# Altium schematic sheet CurrentSensing.SchDoc
size A
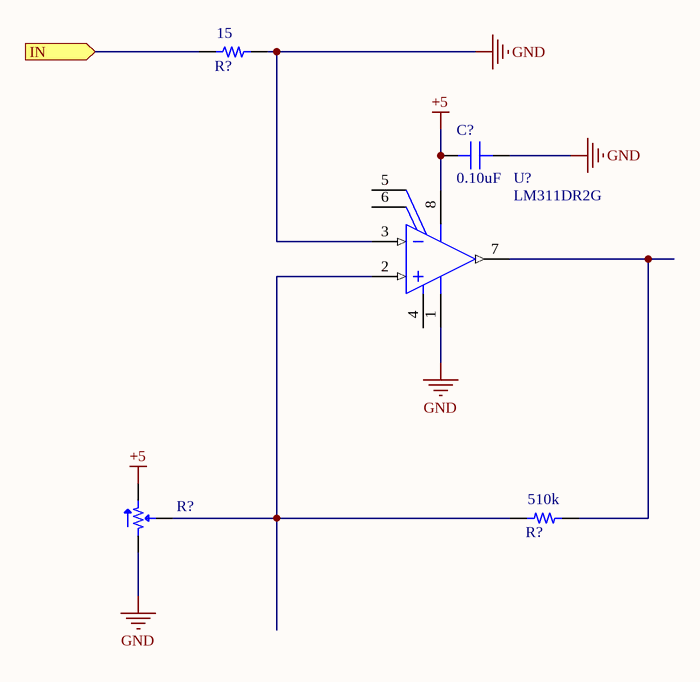
[diagram p0: CurrentSensing.SchDoc]

## Parts
(Parts that share a designator on the sheet are numbered #1, #2 ... from top to bottom, then left to right.)
C?  0.10uF  [CAP 0402/1005]
R?#1  15  [RES 2512/6432]
R?#2  20k  [POT MODEL91A]  (value not drawn)
R?#3  510k  [RES 1206/3216]
U?  LM311DR2G  [ONSC-SOIC-8-751-07_V]

## Ports
IN (in)

## Nets
+5: C?.1 R?#2.3 U?.8(VCC)
GND: C?.2 R?#1.2 R?#2.1 U?.1(GND) U?.3(IN-)
IN: R?#1.1 ; port IN
NetR?#2_2: R?#2.2 R?#3.1 U?.2(IN+)
NetR?#3_2: R?#3.2 U?.7(OUT)

Not connected (* = marked no-connect by the designer): U? 4(VEE) 5(BALANCE) 6(BALANCE/STROBE)

## Library data of the parts
C? = GRM155R71C104JA88D: CAP CER 0.1UF 16V X7R 0402; Manufacturer: Murata Electronics North America; TemperatureRange: -55C ~ 125C; Tolerance: 5%; Value: 0.10uF; Part Number: GRM155R71C104JA88D; PartId: 12366; Supplier 1: Digi-Key; Supplier Part Number 1: 490-6327-2-ND; ComponentLink1Description: Datasheet; ComponentLink1URL: http://www.murata.com/~/media/webrenewal/support/library/catalog/products/capacitor/mlcc/c02e.pdf; ComponentLink2Description: Digi-Key Listing; ComponentLink2URL: https://www.digikey.com/product-detail/en/murata-electronics-north-america/GRM155R71C104JA88D/490-6327-2-ND/2610891; TemperatureCoefficient: X7R; Voltage: 16V; Price: 0.0046; Device Package: 0402 (1005 Metric)
R?#1 = CRM2512-FX-15R0ELF: RES SMD 15 OHM 1% 2W 2512; Manufacturer: Bourns Inc; TemperatureRange: -55C ~ 155C; TemperatureCoefficient: 100ppm/°C; Value: 15; Part Number: CRM2512-FX-15R0ELF; PartId: 10238; Supplier 1: Digi-Key; Supplier Part Number 1: CRM2512-FX-15R0ELFCT-ND; ComponentLink1Description: Datasheet; ComponentLink1URL: https://www.bourns.com/docs/Product-Datasheets/CRM.pdf; ComponentLink2Description: Digi-Key Listing; ComponentLink2URL: https://www.digikey.com/product-detail/en/bourns-inc/CRM2512-FX-15R0ELF/CRM2512-FX-15R0ELFCT-ND/9677730; Tolerance: 1%; PowerRating: 2W; Price: 0.63; Device Package: 2512 (6432 Metric)
R?#2 = 91AR20KLF: TRIMMER 20K OHM 3/8" CERMET TH; Manufacturer: TT Electronics/BI; Tolerance: 20%; PowerRating: 0.5W, 1/2W; Number Of Turns: Single; Adjustment Type: Top Adjustment; Value: 20k; Part Number: 91AR20KLF; PartId: 7167; Supplier 1: Digi-Key; Supplier Part Number 1: 987-1170-ND; ComponentLink1Description: Datasheet; ComponentLink1URL: http://www.bitechnologies.com/pdfs/91.pdf; ComponentLink2Description: Digi-Key Listing; ComponentLink2URL: http://www.digikey.ca/product-detail/en/91AR20KLF/987-1170-ND/2408748; Price: 2.25; Type: Through Hole
R?#3 = ERJ-8GEYJ514V: RES SMD 510K OHM 5% 1/4W 1206; Manufacturer: Panasonic Electronic Components; TemperatureRange: -55C ~ 155C; TemperatureCoefficient: 200ppm/C; PowerRating: 0.25W, 1/4W; Value: 510k; Part Number: ERJ-8GEYJ514V; PartId: 11855; Supplier 1: Digi-Key; Supplier Part Number 1: P510KETR-ND; ComponentLink1Description: Datasheet; ComponentLink1URL: http://industrial.panasonic.com/www-cgi/jvcr13pz.cgi?E+PZ+3+AOA0001+ERJ8GEYJ514V+7+WW; ComponentLink2Description: Digi-Key Listing; ComponentLink2URL: https://www.digikey.com/product-detail/en/panasonic-electronic-components/ERJ-8GEYJ514V/P510KETR-ND/21336; Tolerance: 5%; Price: 0.0045; Device Package: 1206 (3216 Metric)
U? = CMP-1305-00058-1: Single Comparator, 5 to 30 V, 0 to 70 degC, 8-Pin SOIC, Pb-Free, Tape and Reel; Manufacturer: On Semiconductor; VCC Max (V): 30; VCC Min (V): 5; ICC Typ (mA): 2.4; ComponentLink3Description: Package Specification; ComponentLink1URL: http://www.onsemi.com/; ComponentLink1Description: Manufacturer URL; Mounting Technology: Surface Mount; PackageDescription: 8-Pin Small Outline Integrated Circuit, Body 4.9 x 3.9 mm, Pitch 1.27 mm; ComponentLink2Description: Datasheet; RoHS: TRUE; ComponentLink2URL: http://www.onsemi.com/pub_link/Collateral/LM211-D.PDF; PackageVersion: Rev. AK, 02/2011; PackageReference: SOIC-8-751-07; DatasheetVersion: Rev. 6; Packing: Tape and Reel; ComponentLink3URL: http://www.onsemi.com/pub_link/Collateral/751-07.PDF; PartNumber: LM311DR2G